# Altium schematic sheet Power.SchDoc
size A
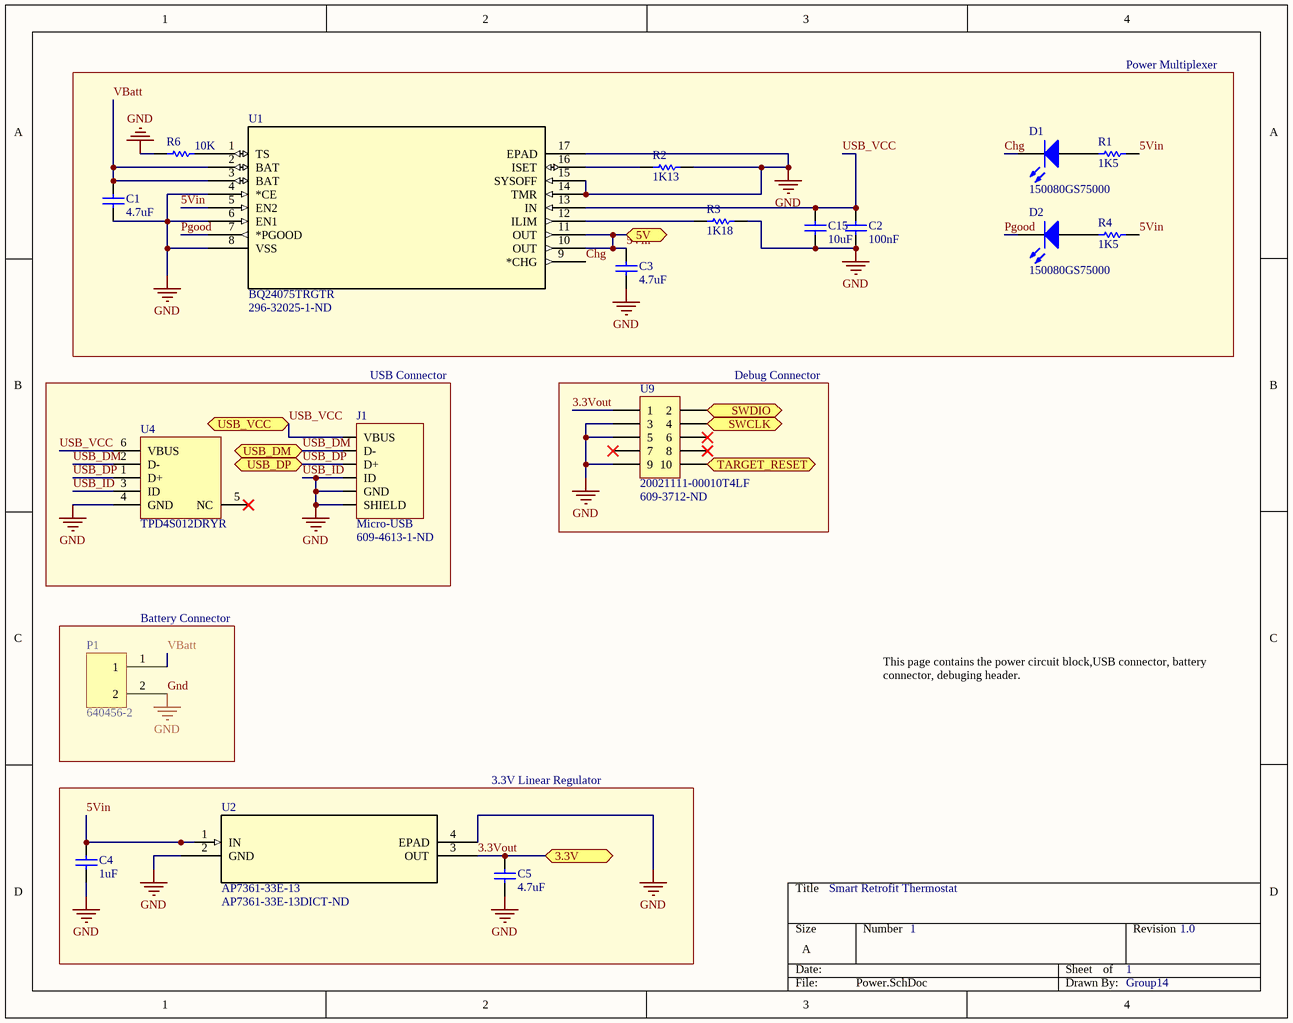
[diagram p0: Power.SchDoc]

## Parts
C1  4.7uF  [CAPC0805(2012)155_L]
C2  100nF  [CAPC0805(2012)100_L]
C3  4.7uF  [CAPC0805(2012)155_L]
C4  1uF  [CAPC0805(2012)100_L]
C5  4.7uF  [CAPC0805(2012)155_L]
C15  10uF  [CAPC0805(2012)100_L]
D1  150080GS75000  [0805_A]
D2  150080GS75000  [0805_A]
J1  Micro-USB  Supplier Part Number 1: 609-4613-1-ND  [10118192-0001LF]
P1  640456-2  [640456-2]
R1  1K5  [RESC0805(2012)_M]
R2  1K13  [RESC0805(2012)_L]
R3  1K18  [RESC0805(2012)_M]
R4  1K5  [RESC0805(2012)_M]
R6  10K  [RESC0805(2012)_M]
U1  BQ24075TRGTR  Supplier Part Number 1: 296-32025-1-ND  [RGT16_1P7X1P7]
U2  AP7361-33E-13  Supplier Part Number 1: AP7361-33E-13DICT-ND  [SOT-223]
U4  TPD4S012DRYR  [DRY0006A]
U9  20021111-00010T4LF  Supplier Part Number 1: 609-3712-ND  [20021111-00010T4LF]

## Blocks framed on the sheet
Power Multiplexer: C1-C3 C15 D1 D2 R1-R4 R6 U1
USB Connector: J1 U4
Debug Connector: U9
Battery Connector: P1
3.3V Linear Regulator: C4 C5 U2

## Ports
3.3V, 5V, SWCLK (bidir), SWDIO (bidir), TARGET_RESET (out), USB_DM (bidir), USB_DP (bidir), USB_VCC

## Nets
Gnd: C1.1 C2.1 C3.1 C4.1 C5.1 C15.1 J1.4(ID) J1.5(GND) J1.6(SHIELD) P1.2 R2.2 R3.2 R6.1 U1.4(*CE) U1.6(EN1) U1.8(VSS) U1.14(TMR) U1.15(SYSOFF) U1.17(EPAD) U2.2(GND) U2.4(EPAD) U4.3(ID) U4.4(GND) U9.3 U9.5 U9.9  [also labelled USB_ID]
3.3Vout: C5.2 U2.3(OUT) U9.1 ; port 3.3V
5Vin: C3.2 C4.2 R1.2 R4.2 U1.5(EN2) U1.10(OUT) U1.11(OUT) U2.1(IN) ; port 5V
Chg: D1.1(K) U1.9(*CHG)
Pgood: D2.1(K) U1.7(*PGOOD)
SWCLK: U9.4 ; port SWCLK
SWDIO: U9.2 ; port SWDIO
TARGET_RESET: U9.10 ; port TARGET_RESET
USB_DM: J1.2(D-) U4.2(D-) ; port USB_DM
USB_DP: J1.3(D+) U4.1(D+) ; port USB_DP
USB_VCC: C2.2 C15.2 J1.1(VBUS) U1.13(IN) U4.6(VBUS) ; port USB_VCC
VBatt: C1.2 P1.1 U1.2(BAT) U1.3(BAT)
NetD1_2: D1.2(A) R1.1
NetD2_2: D2.2(A) R4.1
NetR2_1: R2.1 U1.16(ISET)
NetR3_1: R3.1 U1.12(ILIM)
NetR6_2: R6.2 U1.1(TS)

Not connected (* = marked no-connect by the designer): U4 5(NC)*; U9 6* 7* 8*

## Notes on the sheet
- This page contains the power circuit block,USB connector, battery connector, debuging header.
- Smart Retrofit Thermostat
- 1
- 1.0
- Group14

## Library data of the parts
C1 C3 C5 = CMP-1036-04882-1: CAP 4.7uF 10V ±10% 0805 (2012 Metric) Thickness 1.55mm SMD; Case-EIA: 0805; Tolerance: Â±10%; Case-Metric: 2012; Value: 4.7uF; Rated Voltage: 10 V; Max Thickness: 1.55 mm; Technology: SMT
C2 = CMP-1036-04407-1: CAP 100nF 16V -20% to +80% 0805 (2012 Metric) Thickness 1mm SMD; Case-EIA: 0805; Case-Metric: 2012; Value: 100nF; Rated Voltage: 16 V; Max Thickness: 1 mm; Technology: SMT; Tolerance: -20% to +80%
C4 = CMP-1036-04734-1: CAP 1uF 6.3V ±20% 0805 (2012 Metric) Thickness 1mm SMD; Case-EIA: 0805; Tolerance: Â±20%; Case-Metric: 2012; Value: 1uF; Rated Voltage: 6.3 V; Max Thickness: 1 mm; Technology: SMT
C15 = CMP-1036-04930-1: CAP 10uF 16V ±20% 0805 (2012 Metric) Thickness 1mm SMD; Case-EIA: 0805; Tolerance: Â±20%; Case-Metric: 2012; Value: 10uF; Rated Voltage: 16 V; Max Thickness: 1 mm; Technology: SMT
D1 D2 = CMP-1426-00007-1: SMD mono-color Chip LED, WL-SMCW, Green; Manufacturer: Wuerth Elektronik; PackageReference: 0805_A; Color: Green; PartNumber: 150080GS75000; ComponentLink2URL: http://katalog.we-online.com/led/datasheet/150080GS75000.pdf; ComponentLink1URL: http://www.we-online.com; ComponentLink1Description: Manufacturer URL; ComponentLink2Description: Datasheet
J1 = 10118192-0001LF: CONN USB MICRO B RECPT SMT R/A; HelpURL: http://portal.fciconnect.com/Comergent//fci/drawing/10118192.pdf; Supplier 1: Digi-Key
P1 = 640456-2: CONN HEADER VERT 2POS .100 TIN; Manufacturer: TE Connectivity; Underplate Material: Nickel; Connector Type: Plug,Pin,Header; Contact Resistance: 6mR; Max Current Rating: 5A; Max Voltage Rating (AC): 250V; Number of Positions: 2; Backwall/Post Interruptions: No (Without); Connector System: Wire-to-Board; Plating Thickness: 3.81um; PCB Mount Retention: Without; Gender: Male; Contact Style: Straight; PCB Mounting Orientation: Vertical; Pitch: 2.54mm; Mating Post Length: 7.49mm; PCB Thickness: 0.063inch; Tail Length: 3.56mm; Approvals: CSA; Supplier 1: Digi-Key; Manufacturer Part Number: 640456-2; Stock 1: 141304; Pricing 1: 1=0.12, 10=0.117, 100=0.0724, 500=0.0599, 1000=0.0524, 5000=0.0449, 10000=0.0437 (USD); Mount: Through Hole; Colour: White,Natural,Beige; Contact Plating: Tin; Contact Material: Copper Alloy; Housing Colour: Natural; Housing Material: Polyester; Contact Shape: Square; Min Operating Temperature: -67°C; Max Operating Temperature: 221°C; Package Quantity: 5000; Packaging: Bulk; Termination: Solder; Number of Rows: 1; Fastening Type: Friction; Contact Gender: Male; Voltage Rating (AC): 250V; Number of Contacts: 2; Orientation: Straight; Contact Retention: No (Without); Mating Alignment: No (Without); Mating Retention: No (Without); PCB Mount Alignment: No (Without); Panel Mount Retention: No (Without); Sealable: No (Without); Strain Relief: No (Without); Current Rating: 5A; Number of Poles: 2; Voltage Rating: 250V; Working Voltage: 250V; Length: 5.08mm; Height: 7.87mm; Depth: 5.72mm; Lead Pitch: 2.54mm; Contact Mating Length: 0.295inch; Termination Post Length: 3.56mm; Radiation Hardening: No; ELV: Compliant; Lead Free: Lead Free; Flammability Rating: UL94 V-0; REACH SVHC: No SVHC; ComponentLink1URL: https://datasheet.ciiva.com/709/eng-cd-640456-w1-709680.pdf; ComponentLink1Description: https://datasheet.ciiva.com/709/eng-cd-640456-w1-709680.pdf; ComponentLink2URL: https://datasheet.ciiva.com/3118/eng-ds-82056-mta-0608-3118497.pdf; ComponentLink2Description: https://datasheet.ciiva.com/3118/eng-ds-82056-mta-0608-3118497.pdf; ComponentLink3URL: https://datasheet.ciiva.com/19462/613931-19462481.pdf; ComponentLink3Description: https://datasheet.ciiva.com/19462/613931-19462481.pdf; ComponentLink4URL: https://datasheet.ciiva.com/14156/04384301-14156820.pdf; ComponentLink4Description: https://datasheet.ciiva.com/14156/04384301-14156820.pdf; ComponentLink5URL: https://datasheet.ciiva.com/7128/1866390-7128742.pdf; ComponentLink5Description: https://datasheet.ciiva.com/7128/1866390-7128742.pdf; ComponentLink6URL: https://datasheet.ciiva.com/16401/eng-ds-82056-mta-0608-16401289.pdf; ComponentLink6Description: https://datasheet.ciiva.com/16401/eng-ds-82056-mta-0608-16401289.pdf; ComponentLink7URL: https://datasheet.ciiva.com/16505/eng-ds-82056-mta-0608-16505419.pdf; ComponentLink7Description: https://datasheet.ciiva.com/16505/eng-ds-82056-mta-0608-16505419.pdf; ComponentLink8URL: https://datasheet.ciiva.com/25617/0900766b80027008-25617244.pdf; ComponentLink8Description: https://datasheet.ciiva.com/25617/0900766b80027008-25617244.pdf; ComponentLink9URL: https://datasheet.ciiva.com/11746/0900766b80eb7fdd-11746365.pdf; ComponentLink9Description: https://datasheet.ciiva.com/11746/0900766b80eb7fdd-11746365.pdf; Supplier Part Number 1: A1921-ND
R1 R4 = CMP-1013-00528-1: 1K5 0.125W 1% 0805 (2012 Metric)  SMD; Value: 1500.00 Ohm; Case-Metric: 2012; Case-EIA: 0805; Technology: SMT; Power: 0.125 W; Tolerance: 1 %
R2 = CMP-1013-00515-1: 1K13 0.125W 1% 0805 (2012 Metric)  SMD; Value: 1130.00 Ohm; Case-Metric: 2012; Case-EIA: 0805; Tolerance: 1 %; Technology: SMT; Power: 0.125 W
R3 = CMP-1013-00517-1: 1K18 0.125W 1% 0805 (2012 Metric)  SMD; Value: 1180.00 Ohm; Case-EIA: 0805; Case-Metric: 2012; Tolerance: 1 %; Technology: SMT; Power: 0.125 W
R6 = CMP-1013-00623-1: 10K 0.125W 1% 0805 (2012 Metric)  SMD; Value: 10000.00 Ohm; Case-Metric: 2012; Case-EIA: 0805; Technology: SMT; Power: 0.125 W; Tolerance: 1 %
U1 = BQ24075TRGTR: Imported; Manufacturer: Texas Instruments; Built_By: EMA_UL_Team; C: Copyright (C) 2015 Accelerated Designs. All rights reserved; Vendor: Vendor; Manufacturer_Part_Number: BQ24075TRGTR; Value: Value; Type: Type; RefDes: RefDes; Supplier 1: Digi-Key
U2 = AP7361-33E-13: Imported; Vendor: Diodes Inc; Built_By: EMA_UL_Team; Manufacturer_Part_Number: AP7361-33E-13; Value: Value; Type: Type; RefDes: RefDes; Supplier 1: Digi-Key
U4 = CMP-0326-00038-3: USB ESD Solution with Power Clamp, 4 Channels, -40 to +85 degC, 6-pin SON (DRY), Green (RoHS & no Sb/Br); Manufacturer: Texas Instruments; IO Capacitance(Typ)(pF): 0.8; USB High Speed: TRUE; IEC 61000-4-2 Air-Gap(+/- kV): 10; Breakdown Voltage(Min)(V): 6; PackageDescription: 6-Pin Plastic Small Outline No-Lead, 1 x 1.45 x 0.6 mm Body, 0.5 mm Pitch; ComponentLink2URL: http://www.ti.com/general/docs/lit/getliterature.tsp?genericPartNumber=TPD4S012&fileType=pdf; PackageVersion: revF, Dec-2011; ComponentLink3URL: SamplesURL:http://www.ti.com/product/tpd4s012#samples; ComponentLink2Description: Datasheet; IEC 61000-4-2 Contact(+/- kV): 10; DatasheetVersion: SLVS928A; PackageReference: DRY0006A; ComponentLink3Description: URL Link1; Mounting Technology: Surface Mount; PartNumber: TPD4S012DRYR; ComponentLink1Description: Manufacturer URL; SubFamily: ESD Solution; IO Leakage Current(nA): 10; ComponentLink1URL: http://www.ti.com/; Eco-Plan: Green (RoHS & no Sb/Br)
U9 = 20021111-00010T4LF: CONN HEADER 10POS UNSHD VERT T/H; Manufacturer: Amphenol / FCI; Stack Height: 2.5 mm; Number of Positions / Contacts: 10; Brand: FCI; Pitch: 1.27 mm; Mounting Angle: Vertical; Current Rating: 10 A; Mating Post Length: 3.05 mm; Voltage Rating: 125 V; Manufacturer Part Number: 20021111-00010T4LF; Mounting Style: Through Hole; Product Category: Headers & Wire Housings; RoHS: Details; Series: Minitek; Product Type: Headers; Type: Unshrouded; Number of Positions: 10; Number of Rows: 2; Contact Plating: Gold; Housing Material: Plastic; Termination Style: Through Hole; Contact Material: Nickel; Packaging: Tube; Factory Pack Quantity: 93; Termination Post Length: 2.3 mm; ComponentLink1URL: https://datasheet.ciiva.com/1433/1079612-1433267.pdf; ComponentLink1Description: https://datasheet.ciiva.com/1433/1079612-1433267.pdf; ComponentLink2URL: https://datasheet.ciiva.com/409/20021111-409158.pdf; ComponentLink2Description: https://datasheet.ciiva.com/409/20021111-409158.pdf; ComponentLink3URL: https://datasheet.ciiva.com/5131/20021111-5131386.pdf; ComponentLink3Description: https://datasheet.ciiva.com/5131/20021111-5131386.pdf; ComponentLink4URL: https://datasheet.ciiva.com/9465/20021111-9465402.pdf; ComponentLink4Description: https://datasheet.ciiva.com/9465/20021111-9465402.pdf; Supplier 1: Digi-Key